# Altium schematic sheet RS485_Unit.SchDoc
size C

## Notes on the sheet
- CONFIDENTAL. Do not distribute.
- Page Contents:
- Title:
- Company
- Logo
- Date:
- SIZE:
- C
- DWG Num:
- Time:
- Variant:
- Sheet
- Revision:
- of
- Drawn by:
- Checked by: